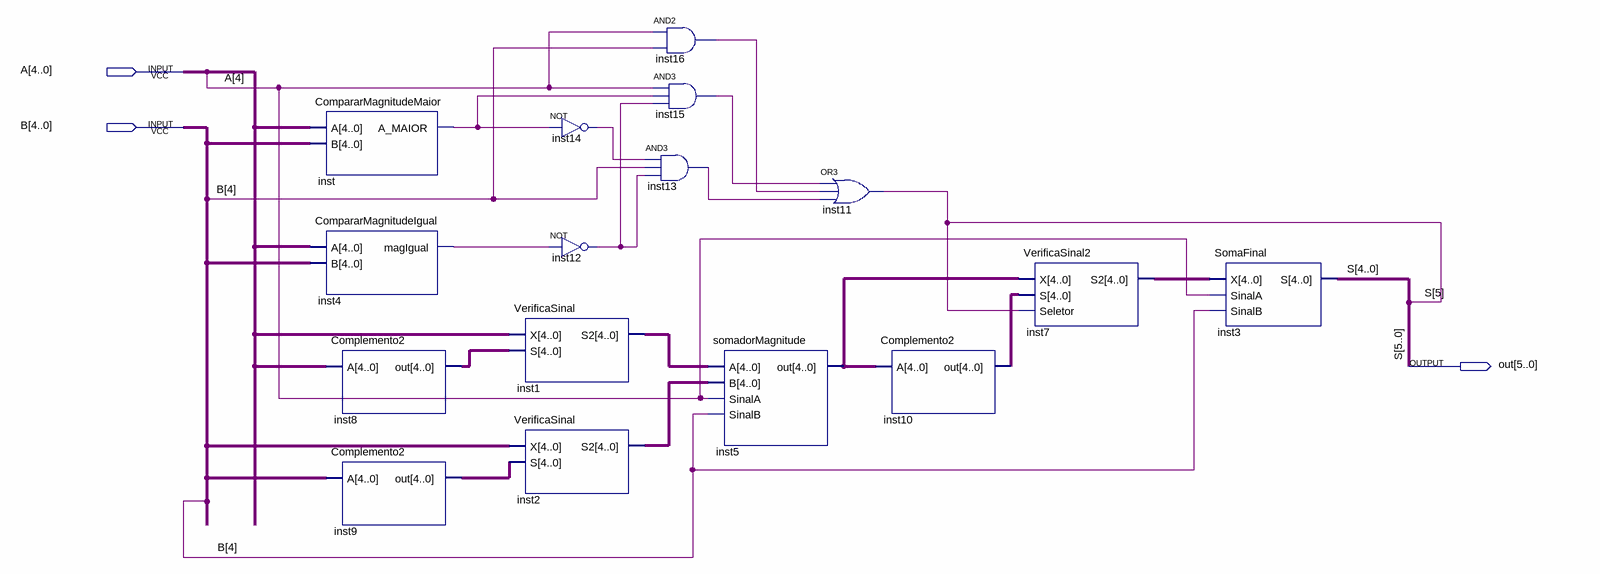
[diagram p0: schematic sheet]
// Quartus schematic SomadorCompleto.bdf as structural Verilog: 16 symbols, 3 pins
module SomadorCompleto (
  input  [4:0] A,
  input  [4:0] B,
  output [5:0] out
);

  wire inst4_magigual, inst12_out, inst13_out, inst14_out, inst15_out, inst16_out, inst_a_maior;
  wire [4:0] inst1_s2, inst2_s2, inst5_out, inst7_s2, inst8_out, inst9_out, inst10_out;

  CompararMagnitudeMaior inst (.A(A), .B(B), .A_MAIOR(inst_a_maior));
  CompararMagnitudeIgual inst4 (.A(A), .B(B), .magIgual(inst4_magigual));
  Complemento2 inst8 (.A(A), .out(inst8_out));
  Complemento2 inst9 (.A(B), .out(inst9_out));
  not inst14 (inst14_out, inst_a_maior);
  not inst12 (inst12_out, inst4_magigual);
  VerificaSinal inst1 (.X(A), .S(inst8_out), .S2(inst1_s2));
  VerificaSinal inst2 (.X(B), .S(inst9_out), .S2(inst2_s2));
  and inst16 (inst16_out, A[4], B[4]);
  and inst15 (inst15_out, A[4], inst_a_maior, inst12_out);
  and inst13 (inst13_out, inst14_out, B[4], inst12_out);
  somadorMagnitude inst5 (.A(inst1_s2), .B(inst2_s2), .SinalA(A[4]), .SinalB(B[4]), .out(inst5_out));
  or inst11 (out[5], inst15_out, inst16_out, inst13_out);
  Complemento2 inst10 (.A(inst5_out), .out(inst10_out));
  VerificaSinal2 inst7 (.X(inst5_out), .S(inst10_out), .Seletor(out[5]), .S2(inst7_s2));
  SomaFinal inst3 (.X(inst7_s2), .SinalA(A[4]), .SinalB(B[4]), .S(out[4:0]));

  // Other names for the same wires on the sheet: S[5:0] = out
endmodule
